# Altium project complete audio amplifier.PrjPcb
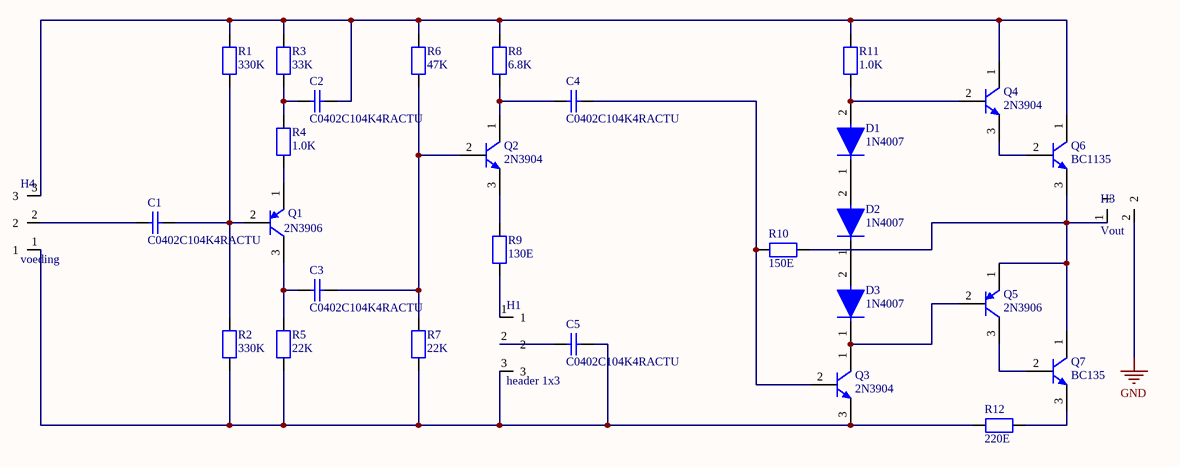
[diagram p0: versterker_L.SchDoc]
3 sheets, 64 parts. Net scope: global (net labels, ports and power ports of the same name join across sheets).
Board file: versterkerSchematic.PcbDoc
Sheets:
  versterker_L.SchDoc
  versterker_R.SchDoc
  aansluiting.SchDoc

## Sheet versterker_L.SchDoc: versterker L
size A4; Author: quinten CRETS; CompanyName: pxl; DocumentNumber: 0.1; Revision: 0; SheetNumber: 1; SheetTotal: 3

### Parts
C1  C0402C104K4RACTU  [capacitor SMD]
C2  C0402C104K4RACTU  [capacitor SMD]
C3  C0402C104K4RACTU  [capacitor SMD]
C4  C0402C104K4RACTU  [capacitor SMD]
C5  C0402C104K4RACTU  [capacitor SMD]
D1  1N4007  [diode]
D2  1N4007  [diode]
D3  1N4007  [diode]
H1  header 1x3  [header 1x3]
H3  Vout  [header 1x2]
H4  voeding  [header 1x3]
Q1  2N3906  [transistor]
Q2  2N3904  [transistor]
Q3  2N3904  [transistor]
Q4  2N3904  [transistor]
Q5  2N3906  [transistor]
Q6  BC1135  [transistor]
Q7  BC135  [transistor]
R1  330K  [resistor smd]
R2  330K  [resistor smd]
R3  33K  [resistor smd]
R4  1.0K  [resistor smd]
R5  22K  [resistor smd]
R6  47K  [resistor smd]
R7  22K  [resistor smd]
R8  6.8K  [resistor smd]
R9  130E  [resistor smd]
R10  150E  [resistor smd]
R11  1.0K  [resistor smd]
R12  220E  [resistor smd]

### Nets
GND: H3.2
NetC1_1: C1.1 H4.2
NetC1_2: C1.2 Q1.2(B) R1.1 R2.2
NetC2_1: C2.1 R3.1 R4.2
NetC2_2: C2.2 H4.3 Q4.1(C) Q6.1(C) R1.2 R3.2 R6.2 R8.2 R11.2
NetC3_1: C3.1 Q1.3(E) R5.2
NetC3_2: C3.2 Q2.2(B) R6.1 R7.2
NetC4_1: C4.1 Q2.1(C) R8.1
NetC4_2: C4.2 Q3.2(B) R10.1
NetC5_1: C5.1 H1.2
NetC5_2: C5.2 H1.3 H4.1 Q3.3(E) R2.1 R5.1 R7.1 R12.1
NetD1_1: D1.1(C) D2.2(A)
NetD1_2: D1.2(A) Q4.2(B) R11.1
NetD2_1: D2.1(C) D3.2(A)
NetD3_1: D3.1(C) Q3.1(C) Q5.2(B)
NetH1_1: H1.1 R9.1
NetH3_1: H3.1 Q5.1(C) Q6.3(E) Q7.1(C) R10.2
NetQ1_1: Q1.1(C) R4.1
NetQ2_3: Q2.3(E) R9.2
NetQ4_3: Q4.3(E) Q6.2(B)
NetQ5_3: Q5.3(E) Q7.2(B)
NetQ7_3: Q7.3(E) R12.2

### Library data of the parts
C1-C5 = capacitor smd: Manufacturer: Kemet; Part Number: C0402C104K4RACTU
D1-D3 = diode: Rectifier diode 1000 V 1 A DO-41, ,; Manufacturer: Diotec; Max Surge Forward Current: 27A; Forward Current: 1A; Max Junction Temp: +175°C; Reverse Voltage: 1000V; Value: 15pF; Peak Reverse Current: 5uA; Category: Diode; Temperature Range Low: -50°C; Automotive: No; Temperature: -50°C to +175°C; Lead Free: Yes; ComponentLink2Description: Datasheet; Max Repetitive Reverse Voltage: 1000V; ComponentLink2URL: https://datasheet.octopart.com/1N4007-Diotec-datasheet-62346875.pdf; Manufacturer Part Number: 1N4007; Device Class L3: Rectifier Diodes; Height: 2.8mm; Octopart: https://octopart.com/1n4007-diotec-4040411; Package: 1N4007; Temperature Range High: +175°C; Device Class L1: Discrete Semiconductors; Device Class L2: Diodes; RoHS: TRUE; Capacitance: 15pF; Ipc Land Pattern Name: DIOAD888W100L520D280
H1 = header 1x3: slider https://benl.rs-online.com/web/p/potentiometers/7377789?cm_mmc=BE-PLA-DS3A-_-google-_-CSS_BE_NL_Passive_Components_Whoop-_-(BE:Whoop!)+Potentiometers-_-7377789&matchtype=&pla-475798367430&gad_source=1&gclid=CjwKCAjwzN-vBhAkEiwAYiO7oPuJbs9GCJj7CrvxiNsXjA7SlcJ2NwzZNKSjfO0eiH0Rvhaxga3QEBoC9gEQAvD_BwE&gclsrc=aw.ds
H3 = header 1x2
H4 = header 1x3
Q1 Q5 = pnp transistor: Amplifier Transistor, NPN Silicon, 3-Pin TO-92, Bulk Box; Manufacturer: On Semiconductor; PartNumber: BC547B; IC Continuous (A): 0.1; fT Min (MHz): 150; DatasheetVersion: Rev. 7; ComponentLink1URL: http://www.onsemi.com/; Polarity: NPN; RoHS: FALSE; ComponentLink1Description: Manufacturer URL; Packing: Bulk Box; PackageDescription: 3-Pin Transistor Outline, Body 4.825 x 3.685 mm, Pitch 1.27 mm; ComponentLink3URL: http://www.onsemi.cn/pub_link/Collateral/2N6426-D.PDF; ComponentLink2Description: Datasheet; PackageVersion: Rev. AM; PackageReference: TO-92-3-29-11_AM_SL; ComponentLink3Description: Package Specification; Mounting Technology: Through Hole; ComponentLink2URL: http://www.onsemi.com/pub_link/Collateral/BC546-D.PDF
Q2-Q4 Q6 Q7 = npn transistor: Amplifier Transistor, NPN Silicon, 3-Pin TO-92, Bulk Box; Manufacturer: On Semiconductor; PartNumber: BC547B; IC Continuous (A): 0.1; fT Min (MHz): 150; DatasheetVersion: Rev. 7; ComponentLink1URL: http://www.onsemi.com/; Polarity: NPN; RoHS: FALSE; ComponentLink1Description: Manufacturer URL; Packing: Bulk Box; PackageDescription: 3-Pin Transistor Outline, Body 4.825 x 3.685 mm, Pitch 1.27 mm; ComponentLink3URL: http://www.onsemi.cn/pub_link/Collateral/2N6426-D.PDF; ComponentLink2Description: Datasheet; PackageVersion: Rev. AM; PackageReference: TO-92-3-29-11_AM_SL; ComponentLink3Description: Package Specification; Mounting Technology: Through Hole; ComponentLink2URL: http://www.onsemi.com/pub_link/Collateral/BC546-D.PDF
R1-R12 = resistor smd: Manufacturer: Vishay Dale; Part Number: CRCW08050000Z0EA

## Sheet versterker_R.SchDoc: versterker R
size A4; Author: quinten CRETS; CompanyName: pxl; DocumentNumber: 0.1; Revision: 0; SheetNumber: 2; SheetTotal: 3
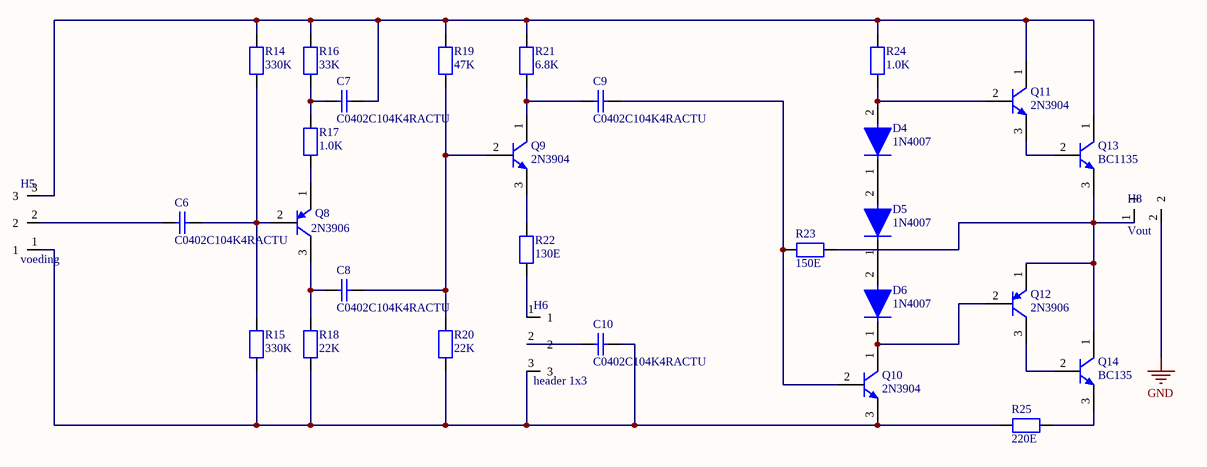
[diagram p1: versterker_R.SchDoc]

### Parts
C6  C0402C104K4RACTU  [capacitor SMD]
C7  C0402C104K4RACTU  [capacitor SMD]
C8  C0402C104K4RACTU  [capacitor SMD]
C9  C0402C104K4RACTU  [capacitor SMD]
C10  C0402C104K4RACTU  [capacitor SMD]
D4  1N4007  [diode]
D5  1N4007  [diode]
D6  1N4007  [diode]
H5  voeding  [header 1x3]
H6  header 1x3  [header 1x3]
H8  Vout  [header 1x2]
Q8  2N3906  [transistor]
Q9  2N3904  [transistor]
Q10  2N3904  [transistor]
Q11  2N3904  [transistor]
Q12  2N3906  [transistor]
Q13  BC1135  [transistor]
Q14  BC135  [transistor]
R14  330K  [resistor smd]
R15  330K  [resistor smd]
R16  33K  [resistor smd]
R17  1.0K  [resistor smd]
R18  22K  [resistor smd]
R19  47K  [resistor smd]
R20  22K  [resistor smd]
R21  6.8K  [resistor smd]
R22  130E  [resistor smd]
R23  150E  [resistor smd]
R24  1.0K  [resistor smd]
R25  220E  [resistor smd]

### Nets
GND: H8.2
NetC6_1: C6.1 H5.2
NetC6_2: C6.2 Q8.2(B) R14.1 R15.2
NetC7_1: C7.1 R16.1 R17.2
NetC7_2: C7.2 H5.3 Q11.1(C) Q13.1(C) R14.2 R16.2 R19.2 R21.2 R24.2
NetC8_1: C8.1 Q8.3(E) R18.2
NetC8_2: C8.2 Q9.2(B) R19.1 R20.2
NetC9_1: C9.1 Q9.1(C) R21.1
NetC9_2: C9.2 Q10.2(B) R23.1
NetC10_1: C10.1 H6.2
NetC10_2: C10.2 H5.1 H6.3 Q10.3(E) R15.1 R18.1 R20.1 R25.1
NetD4_1: D4.1(C) D5.2(A)
NetD4_2: D4.2(A) Q11.2(B) R24.1
NetD5_1: D5.1(C) D6.2(A)
NetD6_1: D6.1(C) Q10.1(C) Q12.2(B)
NetH6_1: H6.1 R22.1
NetH8_1: H8.1 Q12.1(C) Q13.3(E) Q14.1(C) R23.2
NetQ8_1: Q8.1(C) R17.1
NetQ9_3: Q9.3(E) R22.2
NetQ11_3: Q11.3(E) Q13.2(B)
NetQ12_3: Q12.3(E) Q14.2(B)
NetQ14_3: Q14.3(E) R25.2

### Library data of the parts
C6-C10 = capacitor smd: Manufacturer: Kemet; Part Number: C0402C104K4RACTU
D4-D6 = diode: as D1 on sheet versterker_L; Category: Diode; Temperature Range Low: -50°C; Automotive: No; Temperature: -50°C to +175°C; Lead Free: Yes; ComponentLink2Description: Datasheet; Max Repetitive Reverse Voltage: 1000V; ComponentLink2URL: https://datasheet.octopart.com/1N4007-Diotec-datasheet-62346875.pdf; Manufacturer Part Number: 1N4007; Device Class L3: Rectifier Diodes; Height: 2.8mm; Octopart: https://octopart.com/1n4007-diotec-4040411; Package: 1N4007; Temperature Range High: +175°C; Device Class L1: Discrete Semiconductors; Device Class L2: Diodes; RoHS: TRUE; Capacitance: 15pF; Ipc Land Pattern Name: DIOAD888W100L520D280
H5 = header 1x3
H6 = header 1x3: as H1 on sheet versterker_L
H8 = header 1x2
Q8 Q12 = pnp transistor: as Q1 on sheet versterker_L; DatasheetVersion: Rev. 7; ComponentLink1URL: http://www.onsemi.com/; Polarity: NPN; RoHS: FALSE; ComponentLink1Description: Manufacturer URL; Packing: Bulk Box; PackageDescription: 3-Pin Transistor Outline, Body 4.825 x 3.685 mm, Pitch 1.27 mm; ComponentLink3URL: http://www.onsemi.cn/pub_link/Collateral/2N6426-D.PDF; ComponentLink2Description: Datasheet; PackageVersion: Rev. AM; PackageReference: TO-92-3-29-11_AM_SL; ComponentLink3Description: Package Specification; Mounting Technology: Through Hole; ComponentLink2URL: http://www.onsemi.com/pub_link/Collateral/BC546-D.PDF
Q9-Q11 Q13 Q14 = npn transistor: as Q2 on sheet versterker_L; DatasheetVersion: Rev. 7; ComponentLink1URL: http://www.onsemi.com/; Polarity: NPN; RoHS: FALSE; ComponentLink1Description: Manufacturer URL; Packing: Bulk Box; PackageDescription: 3-Pin Transistor Outline, Body 4.825 x 3.685 mm, Pitch 1.27 mm; ComponentLink3URL: http://www.onsemi.cn/pub_link/Collateral/2N6426-D.PDF; ComponentLink2Description: Datasheet; PackageVersion: Rev. AM; PackageReference: TO-92-3-29-11_AM_SL; ComponentLink3Description: Package Specification; Mounting Technology: Through Hole; ComponentLink2URL: http://www.onsemi.com/pub_link/Collateral/BC546-D.PDF
R14-R25 = resistor smd: as R1 on sheet versterker_L

## Sheet aansluiting.SchDoc
size A4; SheetNumber: 3; SheetTotal: 3
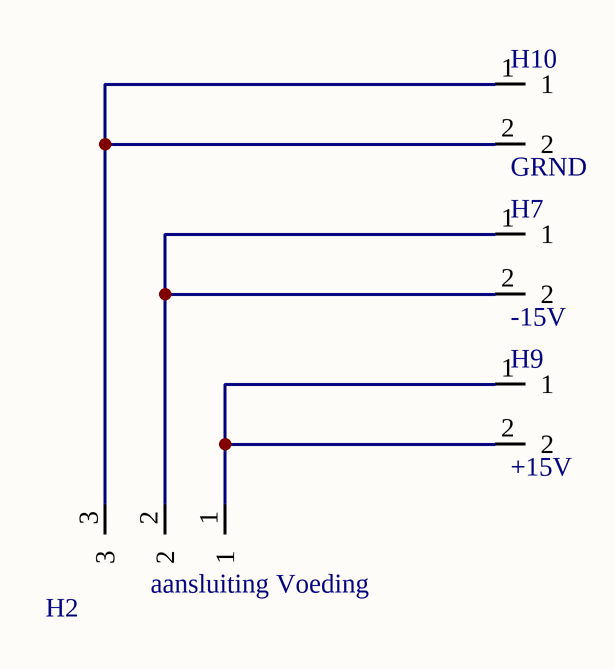
[diagram p2: aansluiting.SchDoc]

### Parts
H2  aansluiting Voeding  [header 1x3]
H7  -15V  [header 1x2]
H9  +15V  [header 1x2]
H10  GRND  [header 1x2]

### Nets
NetH2_1: H2.1 H9.1 H9.2
NetH2_2: H2.2 H7.1 H7.2
NetH2_3: H2.3 H10.1 H10.2

### Library data of the parts
H2 = header 1x3
H7 H9 H10 = header 1x2

## Nets that join several sheets
GND: versterker_L (H3.2), versterker_R (H8.2)